# Altium schematic sheet BeagleBoneCape.SchDoc: Beaglebone Black Environmental Cape
size Legal; DrawnBy: Robin Coxe; Engineer: Robin Coxe; Organization: Quanttux Technologies; Address1: Berkeley, CA USA; Revision: A; SheetNumber: 1; SheetTotal: 1
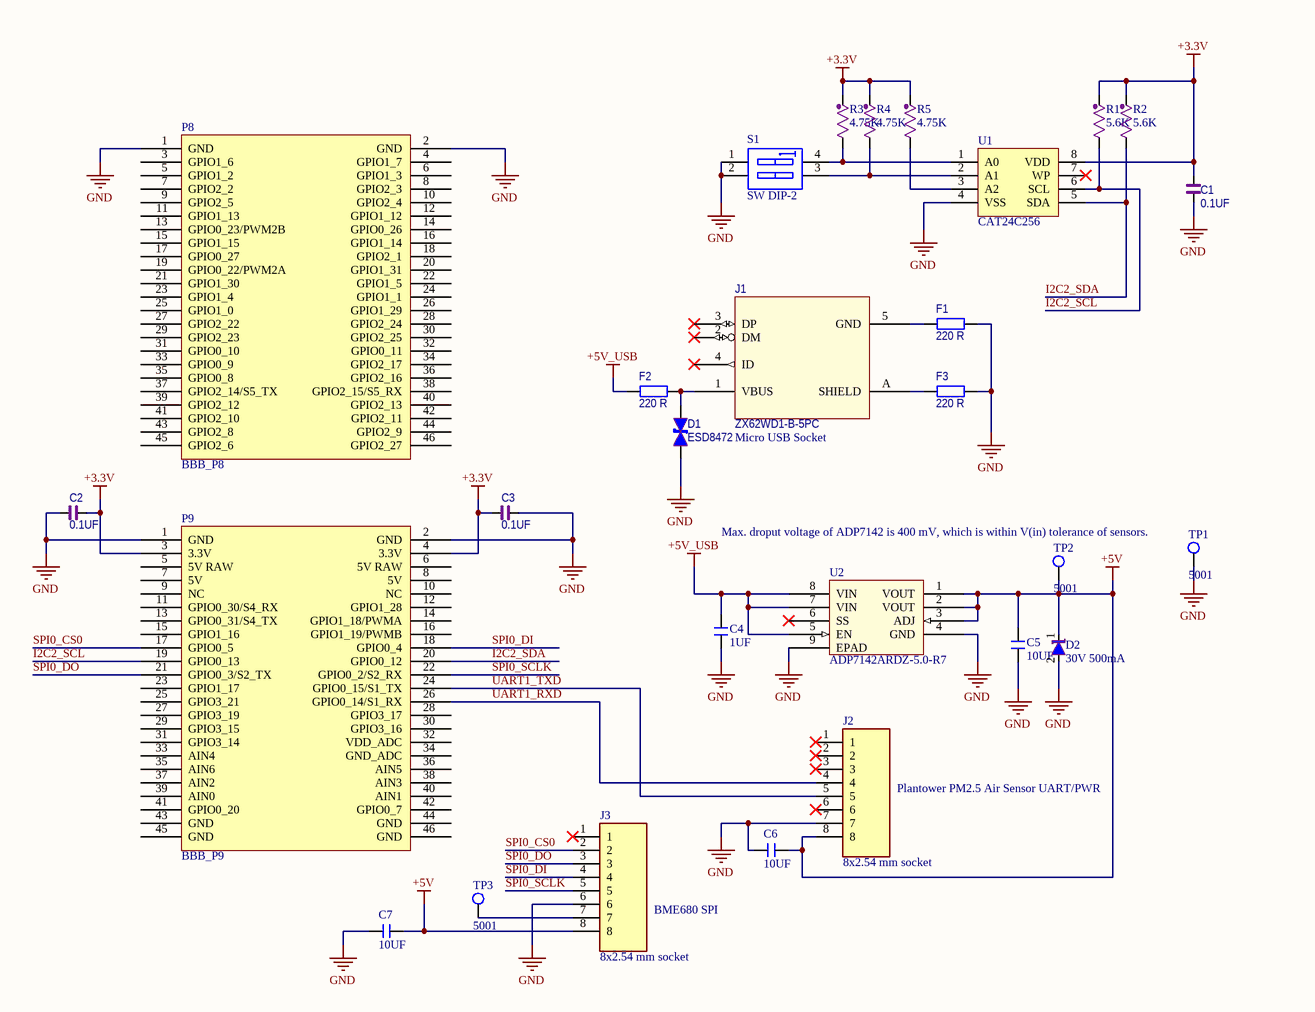
[diagram p0: BeagleBoneCape.SchDoc]

## Parts
C1  0.1UF  [0603-CAP]
C2  0.1UF  [0603-CAP]
C3  0.1UF  [0603-CAP]
C4  1UF  [CAPC2013X140N]
C5  10UF  [CAPC2013X145N]
C6  10UF  [CAPC2013X145N]
C7  10UF  [CAPC2013X145N]
D1  ESD8472  [0201-TVS]
D2  30V 500mA  [SOD-323]
F1  220 R  [INDC1005X55N]
F2  220 R  [INDC1005X55N]
F3  220 R  [INDC1005X55N]
J1  ZX62WD1-B-5PC  Note: Micro USB Socket  [HIROSE_ZX62WD1-B-5PC]
J2  8x2.54 mm socket  [HDR1X8]
J3  8x2.54 mm socket  [HDR1X8]
P8  BBB_P8  [BBB_CAPE_HEADER]
P9  BBB_P9  [BBB_CAPE_HEADER]
R1  5.6K  [0603-RES]
R2  5.6K  [0603-RES]
R3  4.75K  [0603-RES]
R4  4.75K  [0603-RES]
R5  4.75K  [0603-RES]
S1  SW DIP-2  [DIP-4]
TP1  5001  [KEYSTONE_5001]
TP2  5001  [KEYSTONE_5001]
TP3  5001  [KEYSTONE_5001]
U1  CAT24C256  [SOIC127P600X175-8N]
U2  ADP7142ARDZ-5.0-R7  [SOIC127P600X175-9N_ALT]

## Nets
+3.3V: C1.1 C2.2 C3.1 P9.3(3.3V) P9.4(3.3V) R1.2 R2.2 R3.2 R4.2 R5.2 U1.8(VDD)
+5V: C5.1 C6.2 C7.1 D2.1 J2.8 J3.8 TP2.1 U2.1(VOUT) U2.2(VOUT) U2.3(ADJ)
+5V_USB: C4.1 F2.1 U2.5(EN) U2.7(VIN) U2.8(VIN)
GND: C1.2 C2.1 C3.2 C4.2 C5.2 C6.1 C7.2 D1.1 D2.2 F1.2 F3.2 J2.7 J3.6 P8.1(GND) P8.2(GND) P9.1(GND) P9.2(GND) S1.1(A1) S1.2(A2) TP1.1 U1.4(VSS) U2.4(GND) U2.9(EPAD)
I2C2_SCL: P9.19(GPIO0_13) R1.1 U1.6(SCL)
I2C2_SDA: P9.20(GPIO0_12) R2.1 U1.5(SDA)
SPI0_CS0: J3.2 P9.17(GPIO0_5)
SPI0_DI: J3.4 P9.18(GPIO0_4)
SPI0_DO: J3.3 P9.21(GPIO0_3/S2_TX)
SPI0_SCLK: J3.5 P9.22(GPIO0_2/S2_RX)
UART1_RXD: J2.4 P9.26(GPIO0_14/S1_RX)
UART1_TXD: J2.5 P9.24(GPIO0_15/S1_TX)
NetD1_2: D1.2 F2.2 J1.1(VBUS)
NetF1_1: F1.1 J1.5(GND)
NetF3_1: F3.1 J1.A(SHIELD)
NetJ3_7: J3.7 TP3.1
NetR3_1: R3.1 S1.4(B1) U1.1(A0)
NetR4_1: R4.1 S1.3(B2) U1.2(A1)
NetR5_1: R5.1 U1.3(A2)

Not connected (* = marked no-connect by the designer): J1 2(DM)* 3(DP)* 4(ID)*; J2 1* 2* 3* 6*; J3 1*; P8 3(GPIO1_6) 4(GPIO1_7) 5(GPIO1_2) 6(GPIO1_3) 7(GPIO2_2) 8(GPIO2_3) 9(GPIO2_5) 10(GPIO2_4) 11(GPIO1_13) 12(GPIO1_12) 13(GPIO0_23/PWM2B) 14(GPIO0_26) 15(GPIO1_15) 16(GPIO1_14) 17(GPIO0_27) 18(GPIO2_1) 19(GPIO0_22/PWM2A) 20(GPIO1_31) 21(GPIO1_30) 22(GPIO1_5) 23(GPIO1_4) 24(GPIO1_1) 25(GPIO1_0) 26(GPIO1_29) 27(GPIO2_22) 28(GPIO2_24) 29(GPIO2_23) 30(GPIO2_25) 31(GPIO0_10) 32(GPIO0_11) 33(GPIO0_9) 34(GPIO2_17) 35(GPIO0_8) 36(GPIO2_16) 37(GPIO2_14/S5_TX) 38(GPIO2_15/S5_RX) 39(GPIO2_12) 40(GPIO2_13) 41(GPIO2_10) 42(GPIO2_11) 43(GPIO2_8) 44(GPIO2_9) 45(GPIO2_6) 46(GPIO2_27); P9 5(5V_RAW) 6(5V_RAW) 7(5V) 8(5V) 9(NC) 10(NC) 11(GPIO0_30/S4_RX) 12(GPIO1_28) 13(GPIO0_31/S4_TX) 14(GPIO1_18/PWMA) 15(GPIO1_16) 16(GPIO1_19/PWMB) 23(GPIO1_17) 25(GPIO3_21) 27(GPIO3_19) 28(GPIO3_17) 29(GPIO3_15) 30(GPIO3_16) 31(GPIO3_14) 32(VDD_ADC) 33(AIN4) 34(GND_ADC) 35(AIN6) 36(AIN5) 37(AIN2) 38(AIN3) 39(AIN0) 40(AIN1) 41(GPIO0_20) 42(GPIO0_7) 43(GND) 44(GND) 45(GND) 46(GND); U1 7(WP)*; U2 6(SS)*

## Notes on the sheet
- (near TP1) Max. droput voltage of ADP7142 is 400 mV, which is within V(in) tolerance of sensors.
- Plantower PM2.5 Air Sensor UART/PWR
- BME680 SPI
- Title
- Size:
- Date:
- Legal
- Number:
- Time:
- Revision:
- Sheet
- of
- File:

## Library data of the parts
C1-C3 = CAP CER 0.1UF 50V X7R 0603: 0.1µF ±5% 50V Ceramic Capacitor X7R 0603 (1608 Metric); Material: CER; Mfg: Yageo; Mfg PN: CC0603JRX7R9BB104; Symbol Date: 08-22-2016; Package: 0603; Voltage: 50V; Tolerance: 5%; Value: 0.1UF; Dielectric: X7R; Supplier 1: Digi-Key; Supplier Part Number 1: 311-1779-1-ND; Supplier 2: Mouser; Supplier Part Number 2: 603-CC603JRX7R9BB104
C4 = CAP_08053D105KAT2A: 1µF ±10% 25V Ceramic Capacitor X5R 0805 (2012 Metric); Material: CER; MANF: AVX Corporation; Symbol Date: 08-22-2016; Package: 0805; Voltage: 25V; Tolerance: 10%; Value: 1UF; Dielectric: X5R; MANF_P/N: 08053D105KAT2A; Supplier 1: Digi-Key; Supplier Part Number 1: 478-1409-1-ND
C5-C7 = CAP_C2012X5R1E106K125AB: 10µF ±10% 25V Ceramic Capacitor X5R 0805 (2012 Metric); Material: CER; MANF: TDK Corporation; Symbol Date: 08-22-2016; Package: 0805; Voltage: 25V; Tolerance: 10%; Value: 10UF; Dielectric: X5R; MANF_P/N: C2012X5R1E106K125AB; Supplier 1: Digi-Key; Supplier Part Number 1: 445-5984-1-ND
D1 = ESD8472: 20V Clamp 3A (8/20µs) Ipp Tvs Diode Surface Mount 2-X3DFN (0.62x0.32); MANF: ON SEMICONDUCTOR; MANF_P/N: ESD8472MUT3G; Value: ESD8472; Supplier 1: Digi-Key; Supplier 2: Mouser; Supplier Part Number 2: 863-ESD8472MUT5G; Supplier Part Number 1: ESD8472MUT3GOSCT-ND
D2 = DIODE SCHOTTKY 30V 500MA SOD323: Diode Schottky 30V 500mA (DC) Surface Mount SOD-323; MANF: ON Semi; MANF_P/N: NSR0530HT1G; Symbol Date: 08-25-2016; Value: 30V 500mA; Supplier 1: Mouser; Supplier Part Number 1: 863-NSR0530HT1G; Supplier 2: Digi-Key; Supplier Part Number 2: NSR0530HT1GOSCT-ND
F1-F3 = FB_BLM15EG221SN1D: 220 Ohms @ 100MHz 1  Ferrite Bead 0402 (1005 Metric) 700mA 280mOhm; MANF: Murata; MANF_P/N: BLM15EG221SN1D; Version: 1.0; Value: 220 R; VersionDate: 12-08-2015; Supplier 1: Digi-Key; Supplier Part Number 1: 490-4005-1-ND
J1 = USB2_MICRO: USB - micro B USB 2.0 Receptacle Connector 5 Position Surface Mount, Right Angle; MANF: Hirose Electric Co Ltd; Symbol Date: 01-26-2016; MANF_P/N: ZX62WD1-B-5PC; Supplier 1: Digi-Key; Supplier Part Number 1: H12193CT-ND
J2 J3 = HDR_TH_2.54_8: 0.1" 8 pin thru hole receptacle; Mfg: Sullins Connector Solutions; Mfg PN: PPTC081LFBN-RC; Supplier 1: Digi-Key; Supplier Part Number 1: S7006-ND; Value: 8x2.54 mm socket
R1 R2 = RES_5.6K_0.1%_1/10_0603: RES SMD 5.6K 0.1% 1/10W 0603; Mfg PN: RT0603BRD075K6L; Mfg: Yageo; Value: 5.6K; Supplier 1: Digi-Key; Supplier 2: Mouser; Supplier Part Number 1: YAG1699CT-ND; Supplier Part Number 2: 603-RT0603BRD075K6L
R3-R5 = RES_4.75K_0.1%_1/10_0603: RES SMD 4.75K 0.1% 1/10W 0603; Mfg PN: RT0603BRD074K75L; Mfg: Yageo; Value: 4.75K; Supplier 1: Digi-Key; Supplier 2: Mouser; Supplier Part Number 1: YAG2310CT-ND; Supplier Part Number 2: 603-RT0603BRD074K75L
S1 = SW DIP-2: DIP Switch, 2 Position, SPST; Published: 24-Mar-1999; LatestRevisionDate: 17-Jul-2002; LatestRevisionNote: Re-released for DXP Platform.; PackageReference: DIP-4; Publisher: Altium Limited
TP1-TP3 = TP_5001: Test Point, Black, 1-Pin THD, RoHS, Bulk; Other Names: 5001K; Catalog Drawings: 5000Series; Alternate Color: 5004K-ND / -TESTPOINTPCMINI.040"DYELLOW / 5003K-ND / -TESTPOINTPCMINI.040"DORANGE / 5002K-ND / -TESTPOINTPCMINI.040"DWHITE / 5000K-ND / -TESTPOINTPCMINI.040"DRED; MANF: Keystone; Kits: DKTGRS232C-KIT-ND / -TTLCONVERTER; Online Catalog: ColorCodedTestPoints; Datasheet URL: https://ciiva.com/datasheet-click-2917627?src=ciiva&sig=bd195616; Mounting Type: 0.040"(1.02mm)HoleDiameter; Family: TestPoints; RoHS Information: RoHSComplianceStatement; Datasheet Version: Rev. G, 12/2008; Color: Black; Category: TestandMeasurement; Standard Package: 100; Manufacturer URL: http://www.keyelco.com/; Material: Base,Nylon46,UL94V-0; Type: PCTestPoint,Miniature; Terminal: 0.010"x0.020"(0.25mmx0.51mm)PhosphorBronzeWire,SilverPlated; Series: THM; Packaging: Bulk; MANF_P/N: 5001; Supplier 1: Digi-Key; Supplier Part Number 1: 36-5001-ND
U1 = CAT24C256: EEPROM Memory IC 256Kb _32K x 8_ I2C 1MHz 500ns 8-SOIC; Mfg: OnSemi; Mfg PN: CAT24C256WI-GT3; Value: 256Kb I2C EEPROM; Supplier 1: Digi-Key; Supplier 2: Mouser; Supplier Part Number 1: CAT24C256WI-GT3OSCT-ND; Supplier Part Number 2: 698-CAT24C256WI-GT3
U2 = IC_ADP7142ARDZ-5.0-R7: Linear Voltage Regulator IC  1 Output  200mA 8-SOIC-EP; MANF: Analog Devices; Value: ADP7142ARDZ-5.0-R7; MANF_P/N: ADP7142ARDZ-5.0-R7; Supplier 1: Mouser; Supplier 2: Digi-Key; Supplier Part Number 1: 584-P7142ARDZ-5.0-R7; Supplier Part Number 2: ADP7142ARDZ-5.0-R7CT-ND